# Altium schematic sheet esq.SchDoc
size A4; SheetNumber: 1; SheetTotal: 1; Titulo: CIRCUITO CALENTADOR-PRACTICO; Alumno: GRUP0 16; profesor: -; curso: 6TO B; TPN: -; NLista: -; Asignatura: PROYECTO; Año: 2020; Rule: PcbType=ProtelPcb
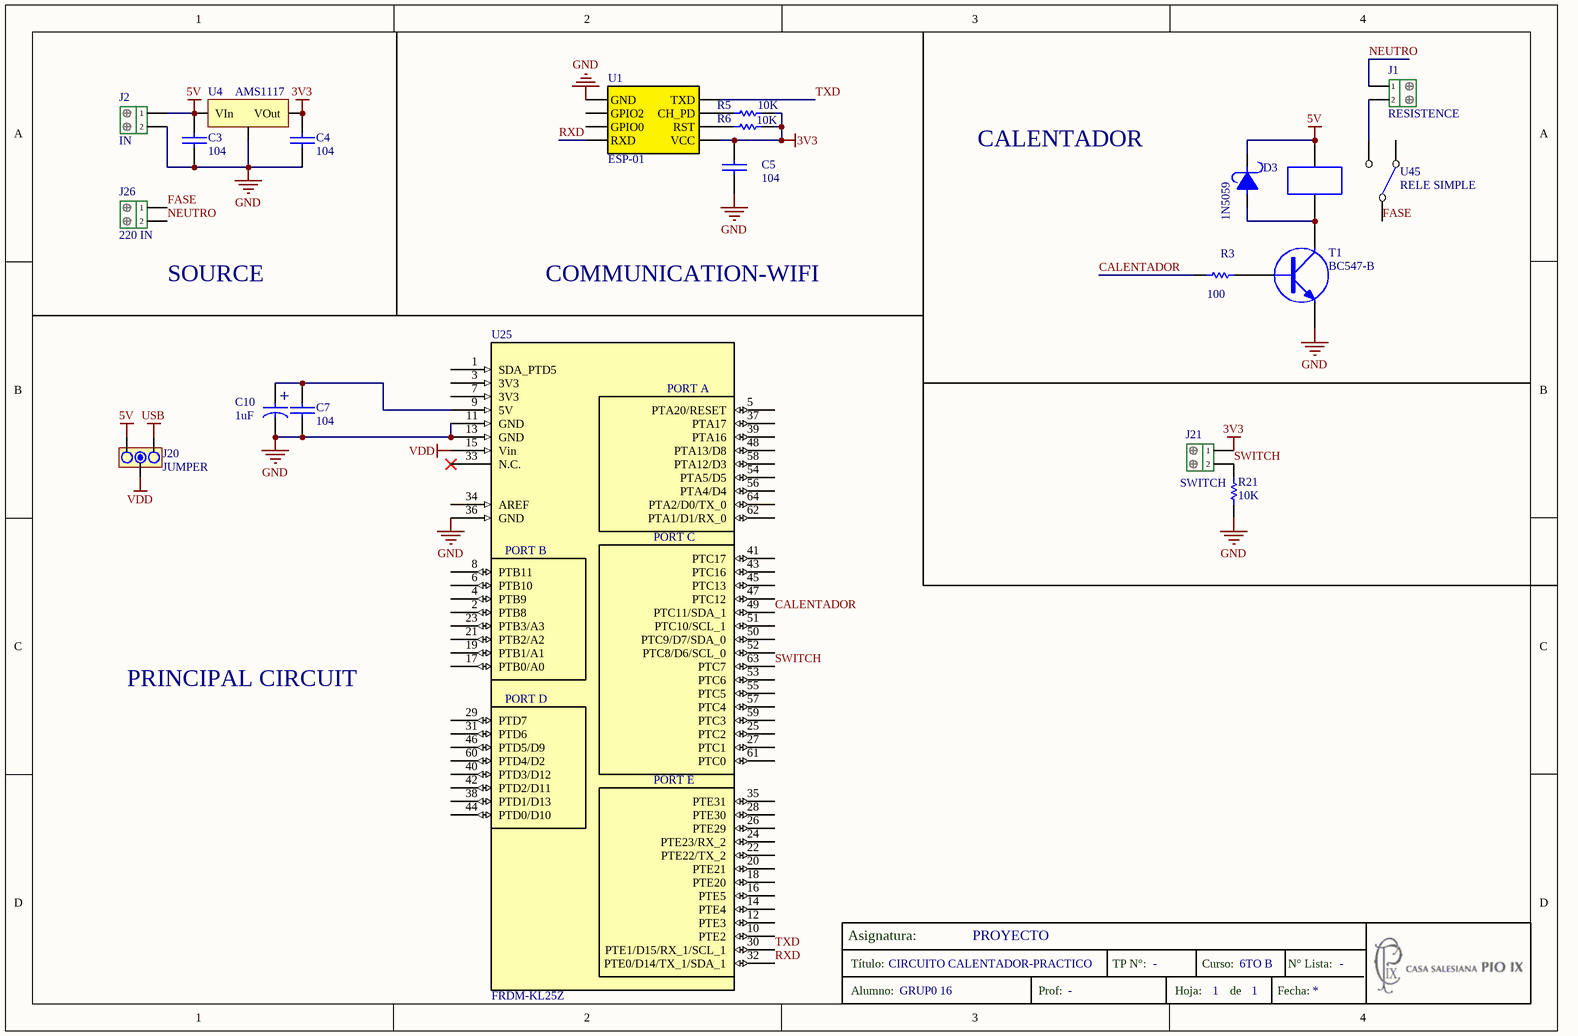
[diagram p0: esq.SchDoc]

## Parts
C3  104  [0805]
C4  104  [1206]
C5  104  [0805]
C7  104  [0805]
C10  1uF  [CAP100RP]
D3  1N5059  [Diodo]
J1  RESISTENCE  [BORNERA2]
J2  IN  [BORNERA2]
J20  JUMPER  [JUMPER3]
J21  SWITCH  [BORNERA2]
J26  220 IN  [BORNERA2]
R3  100  [0805]
R5  10K  [0805]
R6  10K  [0805]
R21  10K  [0805]
T1  BC547-B  [SOT23]
U1  ESP-01  [ESP-01]
U4  AMS1117  [AMS1117]
U25  FRDM-KL25Z  [MICRO]
U45  RELE SIMPLE  [RELE SERIE 943]

## Nets
3V3: C4.1 C5.2 J21.1 R5.1 R6.1 U1.8(VCC) U4.3(VOut)
5V: C3.1 D3.2 J2.1 J20.1 U4.1(VIn) U45.B1
GND: C3.2 C4.2 C5.1 C7.1 C10.2 J2.2 R21.2 T1.3(E) U1.1(GND) U4.2(GND) U25.11(GND) U25.13(GND) U25.36(GND)
USB: J20.3
VDD: J20.2 U25.15(Vin)
CALENTADOR: R3.2 U25.49(PTC11/SDA_1)
FASE: J26.1 U45.C1
NEUTRO: J1.1 J26.2
RXD: U1.4(RXD) U25.32(PTE0/D14/TX_1/SDA_1)
SWITCH: J21.2 R21.1 U25.63(PTC7)
TXD: U1.5(TXD) U25.30(PTE1/D15/RX_1/SCL_1)
NetC7_2: C7.2 C10.1 U25.9(5V)
NetD3_1: D3.1 T1.2(C) U45.B2
NetJ1_2: J1.2 U45.NA1
NetR3_1: R3.1 T1.1(B)
NetR5_2: R5.2 U1.6(CH_PD)
NetR6_2: R6.2 U1.7(RST)

Not connected (* = marked no-connect by the designer): U1 2(GPIO2) 3(GPIO0); U25 1(SDA_PTD5) 2(PTB8) 3(3V3) 4(PTB9) 5(PTA20/RESET) 6(PTB10) 7(3V3) 8(PTB11) 10(PTE2) 12(PTE3) 14(PTE4) 16(PTE5) 17(PTB0/A0) 18(PTE20) 19(PTB1/A1) 20(PTE21) 21(PTB2/A2) 22(PTE22/TX_2) 23(PTB3/A3) 24(PTE23/RX_2) 25(PTC2) 26(PTE29) 27(PTC1) 28(PTE30) 29(PTD7) 31(PTD6) 33(N.C.)* 34(AREF) 35(PTE31) 37(PTA17) 38(PTD1/D13) 39(PTA16) 40(PTD3/D12) 41(PTC17) 42(PTD2/D11) 43(PTC16) 44(PTD0/D10) 45(PTC13) 46(PTD5/D9) 47(PTC12) 48(PTA13/D8) 50(PTC9/D7/SDA_0) 51(PTC10/SCL_1) 52(PTC8/D6/SCL_0) 53(PTC6) 54(PTA5/D5) 55(PTC5) 56(PTA4/D4) 57(PTC4) 58(PTA12/D3) 59(PTC3) 60(PTD4/D2) 61(PTC0) 62(PTA1/D1/RX_0) 64(PTA2/D0/TX_0); U45 NC1

## Notes on the sheet
- CALENTADOR
- (near J26) SOURCE
- COMMUNICATION-WIFI
- PRINCIPAL CIRCUIT
- Asignatura:
- Título:
- TP N°:
- Curso:
- N° Lista:
- Alumno:
- Prof:
- Hoja:
- de
- Fecha:
- (in symbol CAPPOL) +
- (in symbol FRDM-KL25Z) PORT A; PORT C; PORT B; PORT D; PORT E

## Library data of the parts
C3-C5 C7 = CAP: Autor: Guido Spataro; Data: Libebal; Fecha: 07/04/19
C10 = CAPPOL: Cap polarizado
D3 = DIODO SCHOTTKY: Diodo; Autor: Guido Spataro; DAta: https://assets.nexperia.com/documents/outline-drawing/SOD123.pdf; Fecha: 07/04/19
J1 J2 J21 J26 = Bornera_2: Bornera de 2 pines; Autor: Guido Spataro; Datasheet: Libebal; Fecha: 07/04/19
J20 = JUMPER3
R3 R5 R6 R21 = RES: Resistencia; Autor: Guido Spataro; Data: Libebal; Fecha: 07/04/19
T1 = TRANSISTOR NPN
U25 = FRDM-KL25Z: Autor: Guido Spataro; data: https://www.nxp.com/docs/en/data-sheet/MC9S08SH8.pdf; Fecha: 07/04/19